# EAGLE schematic butt_blaster (EAGLE 6.5.0)
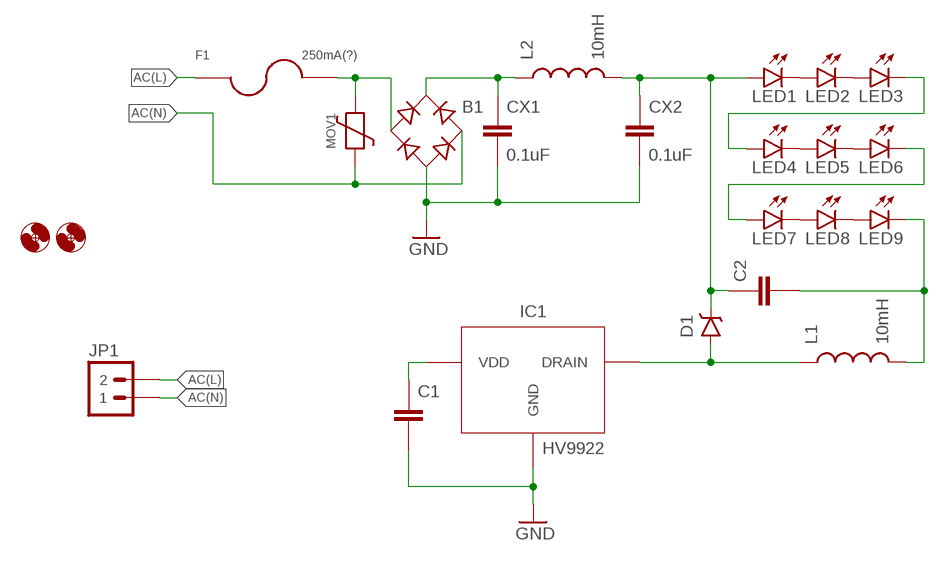
[diagram p0: schematic, sheet 1]

## Parts
B1  RB1ANOSUCK  [RB1A-NOSUCK]
C1  CAPACITOR-CERAMIC025-024X044  [C025-024X044]
C2  CAPACITOR-CERAMIC025-024X044  [C025-024X044]
CX1  0.1uF  CXXC10B5  [XC10B5]
CX2  0.1uF  CXXC10B5  [XC10B5]
D1  DIODE-SCHOTTKYPTH-7.68MM  [DIODE-7.68MM]
F1  250mA(?)  FUSETR5  [TR5]
H1  HOLE#2  [HOLE-#2]
H2  HOLE#2  [HOLE-#2]
IC1  HV9922  [TO-92]
JP1  M025MM  [SCREWTERMINAL-5MM-2]
L1  10mH  INDUCTORRLB0912  [RLB0912]
L2  10mH  INDUCTORAXIAL-PTH-10.16MM  [INDUCTOR-AXIAL-PTH-10.16MM]
LED1  LED5MM_SHORTPADS  [LED5MM_SHORTPADS]
LED2  LED5MM_SHORTPADS  [LED5MM_SHORTPADS]
LED3  LED5MM_SHORTPADS  [LED5MM_SHORTPADS]
LED4  LED5MM_SHORTPADS  [LED5MM_SHORTPADS]
LED5  LED5MM_SHORTPADS  [LED5MM_SHORTPADS]
LED6  LED5MM_SHORTPADS  [LED5MM_SHORTPADS]
LED7  LED5MM_SHORTPADS  [LED5MM_SHORTPADS]
LED8  LED5MM_SHORTPADS  [LED5MM_SHORTPADS]
LED9  LED5MM_SHORTPADS  [LED5MM_SHORTPADS]
MOV1  VARISITORVAR-5.08MM-PTH  [VAR-5.08MM-PTH]

## Nets
AC(L): F1.1 JP1.2
AC(N): B1.AC2 JP1.1 MOV1.1
GND: B1.- C1.2 CX1.2 CX2.2 IC1.2(GND)
N$1: LED1.K(C) LED2.A
N$2: LED2.K(C) LED3.A
N$3: LED4.K(C) LED5.A
N$4: LED5.K(C) LED6.A
N$5: LED3.K(C) LED4.A
N$6: LED6.K(C) LED7.A
N$7: LED7.K(C) LED8.A
N$8: LED8.K(C) LED9.A
N$9: C2.2 L1.2 LED9.K(C)
N$10: D1.A IC1.1(DRAIN) L1.1
N$11: C2.1 CX2.1 D1.K(C) L2.P$2 LED1.A
N$12: B1.AC1 F1.2 MOV1.2
N$13: B1.+ CX1.1 L2.P$1
N$14: C1.1 IC1.3(VDD)

## Library data of the parts
B1 = A_butts:RB1A: RECTIFIER 1 A
C1 C2 = A_butts:CAPACITOR-CERAMIC: CAPACITOR, European symbol
CX1 CX2 = A_butts:CX: X CAPACITOR for power line
D1 = A_butts:DIODE-SCHOTTKY: Schottky diodes in SFE's production catalog BAT20J 1A 23V 0.62Vf RB751 120mA 40V 0.37Vf PMEG4005EJ 0.5A 40V 0.42Vf MBRA140 1A 40V 0.5Vf B340A 3A 40V SMA
F1 = A_butts:FUSE
H1 H2 = A_butts:HOLE: MOUNTING HOLE with drill center marker
IC1 = A_butts:HV9922
JP1 = A_butts:M02: Standard 2-pin 0.1" header. Use with - straight break away headers ( PRT-00116) - right angle break away headers (PRT-00553) - swiss pins (PRT-00743) - machine pins (PRT-00117) - female headers (PRT-00115) Molex polarized connector foot print use with: PRT-08233 with associated crimp pins and housings. 2.54_SCREWTERM for use with PRT-10571. 3.5mm Screw Terminal footprints for PRT-08084 5mm Screw Terminal footprints for use with PRT-08433
L1 L2 = A_butts:INDUCTOR: Inductors Basic Inductor/Choke - 0603 and 1206. Footprints are not proven and vary greatly between part numbers. SRN6045- 33uH, 20% 1.4A SDR0403-560KL - 56uH, 10%, 500mA RMS/740mA peak
LED1-LED9 = A_butts:LED: LEDs Standard schematic elements and footprints for 5mm, 3mm, 1206, and 0603 sized LEDs. 5mm - Spark Fun Electronics SKU : COM-00529 (and others)
MOV1 = A_butts:VARISITOR